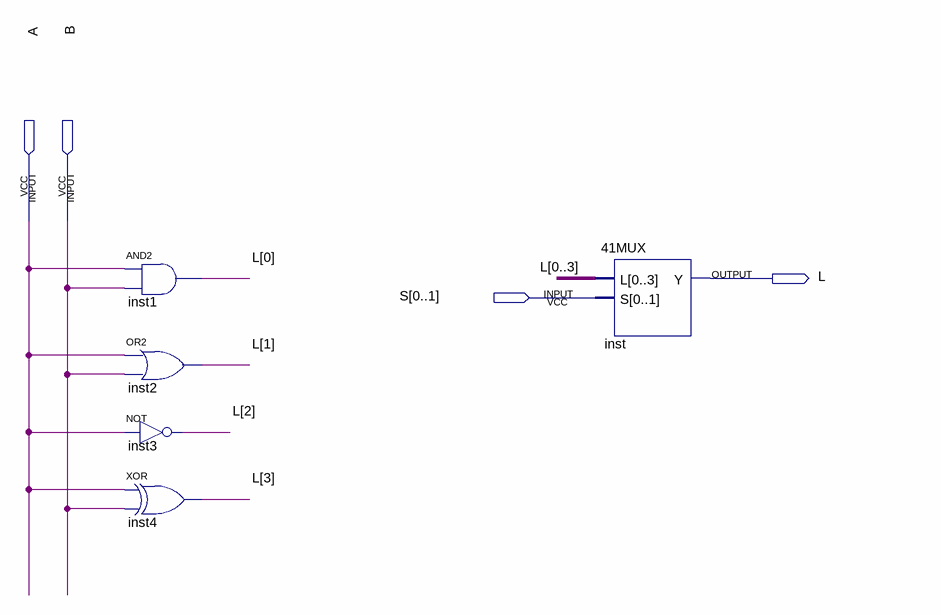
[diagram p0: schematic sheet]
// Quartus schematic 1BitLU.bdf as structural Verilog: 5 symbols, 4 pins
module \1BitLU  (
  input  A,
  input  B,
  input  [0:1] S,
  output L
);

  wire [3:0] L_bus;

  and inst1 (L_bus[0], A, B);
  or inst2 (L_bus[1], A, B);
  not inst3 (L_bus[2], A);
  xor inst4 (L_bus[3], A, B);
  \41MUX  inst (.L({L_bus[0], L_bus[1], L_bus[2], L_bus[3]}), .S(S), .Y(L));
endmodule
